# EAGLE design Beacon (EAGLE 6.1)
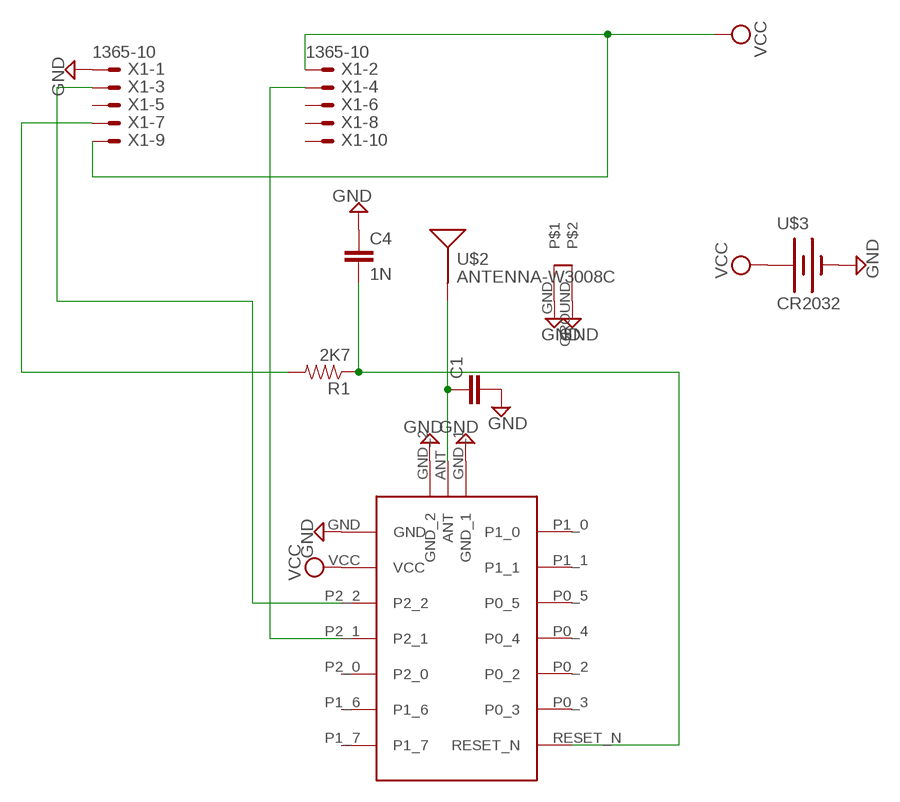
[diagram p0: schematic, sheet 1]

## Parts
C1  CAP0402-CAP  [0402-CAP]
C4  1N  CAP0402-CAP  [0402-CAP]
R1  2K7  RESISTOR0402-RES  [0402-RES]
U$1  BLE4  [BLE4]
U$2  ANTENNA-W3008C  [ANTENNA-W3008C]
U$3  CR2032  [BATTCON_2032]
X1  1365-10  [1365-10]

## Nets
GND: C1.2 C4.1 U$1.GND U$1.GND_1 U$1.GND_2 U$2.GND U$2.GROUND U$3.PWR@2(-) X1.1
N$1: C1.1 U$1.ANT U$2.FEED(SIGNAL)
N$4: U$1.P2_2 X1.3
N$5: C4.2 R1.1 U$1.RESET_N
N$6: U$1.P2_1 X1.4
N$7: R1.2 X1.7
VCC: U$1.VCC U$3.PWR@1(+) X1.2 X1.9
Unconnected: U$1.P0_2 U$1.P0_3 U$1.P0_4 U$1.P0_5 U$1.P1_0 U$1.P1_1 U$1.P1_6 U$1.P1_7 U$1.P2_0 X1.5 X1.6 X1.8 X1.10

## Library data of the parts
C1 C4 = SparkFun-Capacitors:CAP: Capacitor Standard 0603 ceramic capacitor, and 0.1" leaded capacitor.
R1 = SparkFun-Resistors:RESISTOR: Resistor Basic schematic elements and footprints for 0603, 1206, and PTH resistors.
U$1 = foxkn:BLE4
U$2 = SparkFun-RF:ANTENNA-W3008C
U$3 = SparkFun-Electromechanical:CR2032
X1 = con-leotronics:1365-10: DUAL ROW STRAIGHT HEADER 1364 SERIES. 1.27mm x 1.27mm. Without Fixing Post. SMT Source: http://www.leotronics.co.uk/Conexcon/Data%20Sheets/sec.%20A/1364ing.pdf; OC_FARNELL: unknown; OC_NEWARK: unknown

## Board
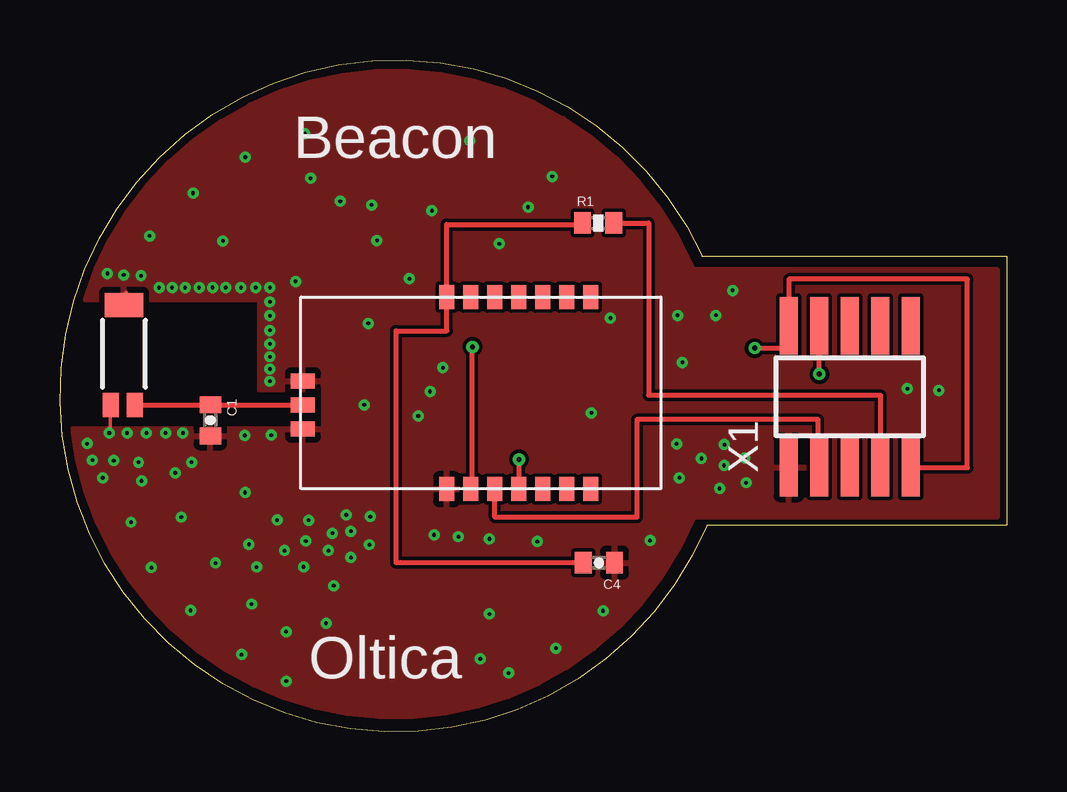
[diagram p1: board, top side]
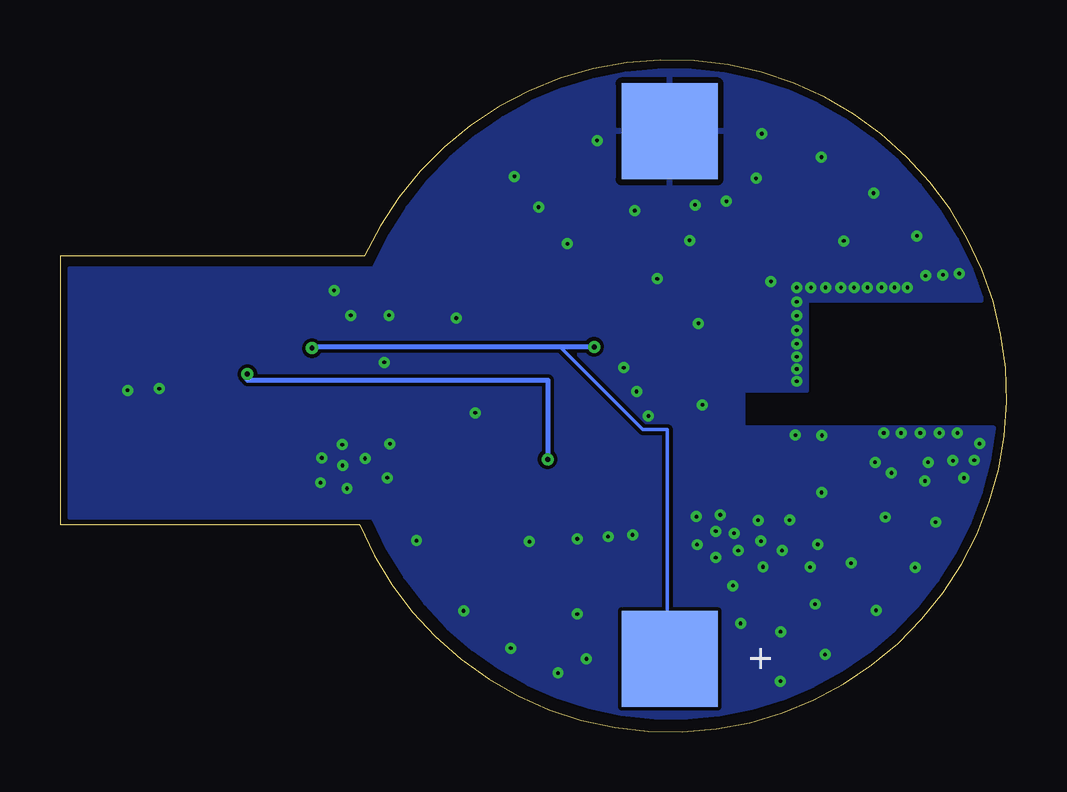
[diagram p2: board, bottom side, seen from below]

Size 39.44 x 28.02 mm. Coordinates in mm from the lower left corner, seen from the top.
Outline: 26.96,8.64 arc-313 26.76,19.84
Outline: 26.75,19.84 39.44,19.84 39.44,8.63 26.95,8.63
Copper layers (1*16): Top 0.035mm / dielectric 1.5mm / Bottom 0.035mm
Design rules: minimum track width 6mil, minimum drill 6mil, track to track 6mil, track to pad 6mil, pad to pad 6mil, via to via 6mil, smd to smd 6mil, copper to edge 8mil, drill to drill 6mil, minimum pad ring 6mil, minimum via ring 6mil, stop-mask expansion 4mil, vias tented up to drill 0mil, thermal gap 10mil

### Footprints (pad centres in the part's own frame; a part is rotated, then mirrored left to right if it is on the bottom)
0402-CAP = smd 0.7 x 0.9: 1 -0.65,0; 2 0.65,0
0402-RES = smd 0.7 x 0.9: 1 -0.65,0; 2 0.65,0
BLE4 = smd 1 x 0.635: ANT 8.54,0.5; GND_1 8.54,-0.5; GND_2 8.54,1.5 | smd 0.635 x 1: GND 2.54,4; P0_2 0.54,-4; P0_3 1.54,-4; P0_4 -0.46,-4; P0_5 -1.46,-4; P1_0 -3.46,-4; P1_1 -2.46,-4; P1_6 -2.46,4; P1_7 -3.46,4; P2_0 -1.46,4; P2_1 -0.46,4; P2_2 0.54,4; RESET_N 2.54,-4; VCC 1.54,4
ANTENNA-W3008C = smd 0.65 x 1: FEED -0.45,2.52; GROUND 0.55,2.52 | smd 1.6 x 1: GND 0,-1.651
BATTCON_2032 = smd 4 x 4: PWR@1 -11.46,0; PWR@2 10.54,0
1365-10 = smd 0.76 x 2.4: 1 -2.54,-2.95; 2 -2.54,2.95; 3 -1.27,-2.95; 4 -1.27,2.95; 5 0,-2.95; 6 0,2.95; 7 1.27,-2.95; 8 1.27,2.95; 9 2.54,-2.95; 10 2.54,2.95

### Placement (x,y rotation side)
C1  6.26,12.99 270 top
C4  22.46,7.06 180 top
R1  22.42,21.22 0 top
U$1  18.66,14.13 180 top
U$2  2.67,16.15 180 top
U$3  14.04,14.5 90 bottom
X1  32.91,13.98 0 top

### Tracks (layer width: path | path; a pad name or v marks a point on that pad's centre or on a via)
GND  (via drill 0.15)
  Top 0.152: U$2.GROUND 2.1,13.59 2.1,12.98 2.1,12.57 v2.05,12.46 | 2.77,18.33 2.71,18.26 2.71,17.86 U$2.GND
  other vias: 4.13,18.53 4.67,18.53 5.21,18.53 5.8,18.53 6.36,18.53 6.91,18.53 7.54,18.53 8.16,18.53 8.74,18.53 8.74,17.93 8.74,17.36 8.74,16.74 8.74,16.18 8.74,15.64 8.74,15.13 8.74,14.62 8.8,12.37 7.7,12.36 5.12,12.46 4.4,12.46 3.6,12.46 2.8,12.46 1.35,11.33 1.13,12.02 3.37,19.02 2.66,19.05 1.98,19.11 28.53,11.42 26.73,11.4 25.94,15.41 25.69,12.01 25.81,10.59 27.48,10.15 27.69,11.98 27.67,11.11 28.59,10.39 24.59,7.97 19.88,7.94 17.89,8.05 16.6,8.14 15.59,8.21 14.92,13.17 15.42,14.19 15.95,15.19 12.67,13.64 12.84,17.03 3.27,11.24 5.48,11.24 4.8,10.79 3.4,10.46 1.78,10.59 2.24,11.31 9.82,18.78 14.56,18.89 18.3,20.35 15.5,21.73 19.5,21.88 22.93,17.25 25.73,17.36 22.14,13.31 27.33,17.36 28.02,18.4 35.31,14.31 36.62,14.24 7.87,7.82 7.71,9.98 9.04,8.83 10.36,8.82 9.35,7.56 11.18,7.56 11.35,8.28 11.93,9.05 12.12,8.36 12.12,7.27 12.89,7.81 12.93,8.98 10.24,7.96 8.19,6.87 10.15,6.88 3.74,20.67 5.55,22.46 7.72,23.96 10.2,24.94 11.68,22.12 17.07,24.66 20.51,23.16 10.44,23.08 6.79,20.47 13.21,20.49 12.98,21.97 9.42,4.18 17.51,3.04 18.69,2.46 20.66,3.49 22.63,5.04 9.43,2.12 7.57,3.23 5.44,5.07 3.81,6.85 2.96,8.74 5.05,8.95 6.48,7.04 7.98,5.33 11.09,4.53 11.4,6.1 17.89,4.91
  pour Top: 26.38,19.29 39.05,19.29 39.05,8.95 26.38,8.95
  pour Bottom: 26.39,19.29 39.04,19.3 39.04,8.96 26.38,8.96 26.38,19.3
  pour Top: 1.04,18.01 arc-337 0.54,12.66 10.98,12.66 10.98,14.25 8.32,14.25 8.32,18.01
  pour Bottom: 1.04,18.01 arc-337 0.53,12.66 10.98,12.66 10.98,14.25 8.32,14.25 8.32,18.01
N$1
  Top 0.152: C1.1 6.37,13.59 6.37,13.63
  Top 0.203: U$2.FEED 6.37,13.63 U$1.ANT
N$4
  Top 0.203: X1.3 31.59,11.03 31.59,13.02 24.03,13.02 24.03,8.94 18.12,8.94 U$1.P2_2
N$5
  Top 0.203: R1.1 21.77,21.16 16.11,21.16 U$1.RESET_N 16.12,16.72 14.01,16.72 14.01,7.06 C4.2
N$6  (via drill 0.2)
  Top 0.203: U$1.P2_1 v19.13,11.36 | v31.64,14.92 X1.4
  Bottom 0.203: v19.13,11.36 19.1,11.36 19.1,14.66 31.64,14.66 v31.64,14.92
N$7
  Top 0.203: R1.2 24.52,21.22 24.52,14.04 34.18,14.04 X1.7
VCC  (via drill 0.2)
  Top 0.203: X1.9 37.81,11.03 37.81,18.87 30.37,18.87 X1.2 30.37,16 v28.94,16 | U$1.VCC 17.19,10.12 v17.19,16.05
  Bottom 0.152: U$3.PWR@1 14.14,3.05 14.14,12.6 15.16,12.6 18.61,16.06 18.61,16.05
  Bottom 0.203: v17.19,16.05 18.61,16.05 28.94,16.05 v28.94,16

### Text on the board
tPlace: Beacon | Oltica